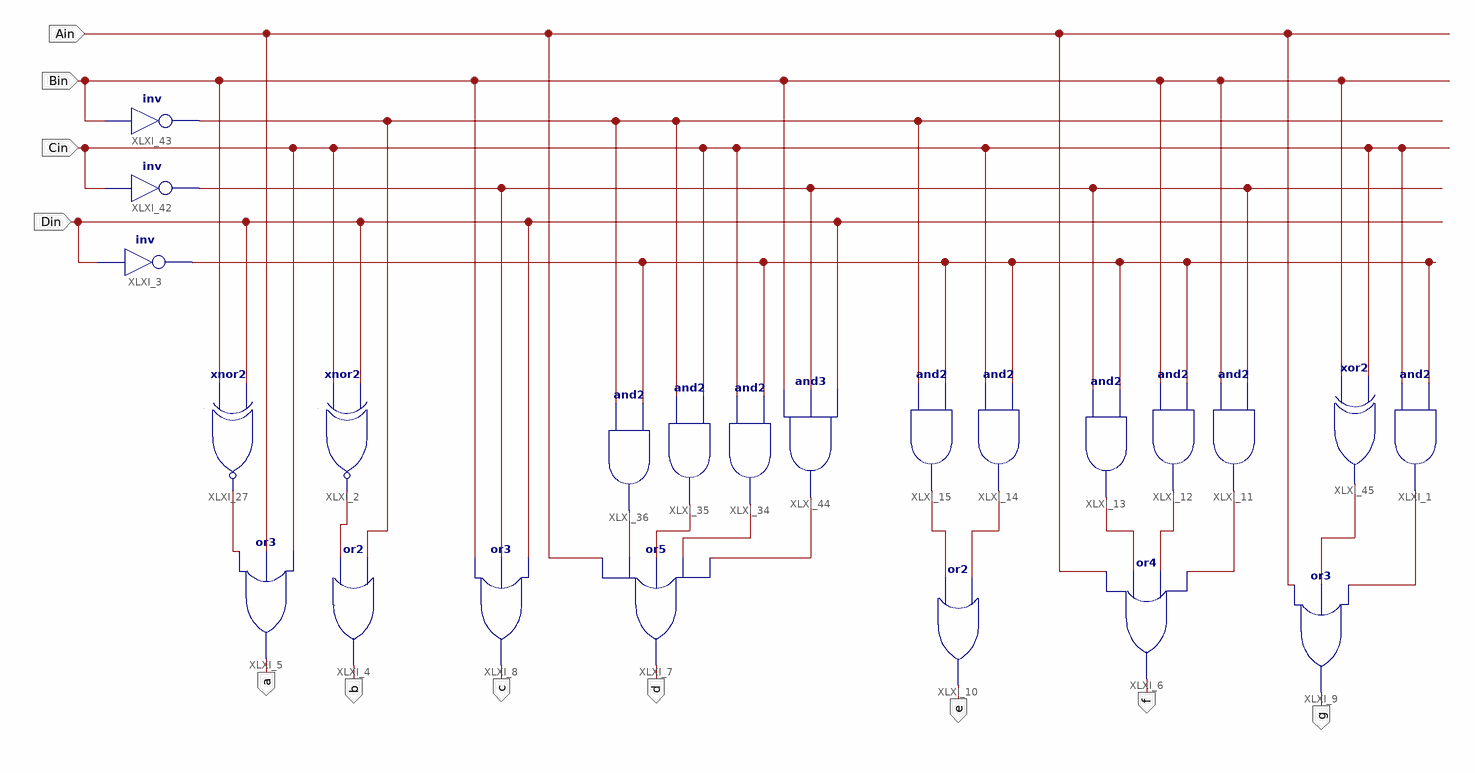
[diagram p0: schematic sheet 1]
// Xilinx ISE schematic Dec_7Seg.sch (spartan3) as structural Verilog: 23 symbols, 11 ports
module Dec_7Seg (
  input  Din,
  input  Cin,
  input  Bin,
  input  Ain,
  output a,
  output b,
  output c,
  output d,
  output e,
  output f,
  output g
);

  wire XLXN_2, XLXN_4, XLXN_9, XLXN_10, XLXN_11, XLXN_13, XLXN_14, XLXN_15, XLXN_16, XLXN_17, XLXN_18,
       XLXN_20, XLXN_21, XLXN_22, XLXN_26, XLXN_27;

  xnor XLXI_2 (XLXN_10, Cin, Din);
  not XLXI_3 (XLXN_2, Din);
  or XLXI_4 (b, XLXN_10, XLXN_11);
  or XLXI_5 (a, XLXN_9, Ain, Cin);
  or XLXI_6 (f, Ain, XLXN_20, XLXN_21, XLXN_22);
  or XLXI_8 (c, Bin, XLXN_4, Din);
  or XLXI_9 (g, Ain, XLXN_26, XLXN_27);
  or XLXI_10 (e, XLXN_17, XLXN_18);
  and XLXI_1 (XLXN_27, Cin, XLXN_2);
  xnor XLXI_27 (XLXN_9, Bin, Din);
  and XLXI_13 (XLXN_20, XLXN_4, XLXN_2);
  and XLXI_11 (XLXN_22, Bin, XLXN_4);
  and XLXI_12 (XLXN_21, Bin, XLXN_2);
  and XLXI_14 (XLXN_18, Cin, XLXN_2);
  and XLXI_15 (XLXN_17, XLXN_11, XLXN_2);
  or XLXI_7 (d, Ain, XLXN_13, XLXN_14, XLXN_15, XLXN_16);
  and XLXI_34 (XLXN_15, Cin, XLXN_2);
  and XLXI_35 (XLXN_14, XLXN_11, Cin);
  and XLXI_36 (XLXN_13, XLXN_11, XLXN_2);
  not XLXI_42 (XLXN_4, Cin);
  not XLXI_43 (XLXN_11, Bin);
  and XLXI_44 (XLXN_16, Bin, XLXN_4, Din);
  xor XLXI_45 (XLXN_26, Bin, Cin);
endmodule
